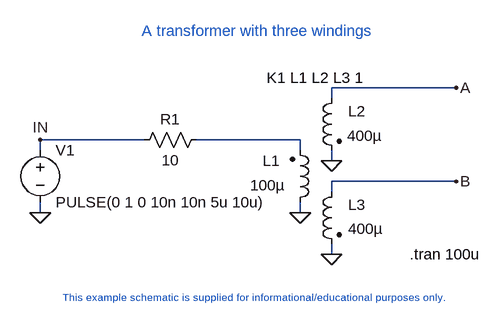
[diagram p0: schematic Transformer2.asc]
Transformer2.asc, the LTspice schematic file:
Version 4
SHEET 1 880 680
WIRE 352 96 160 96
WIRE 160 112 160 96
WIRE -128 176 -288 176
WIRE 112 176 -48 176
WIRE -288 192 -288 176
WIRE 112 192 112 176
WIRE 160 208 160 192
WIRE 352 240 160 240
WIRE 160 256 160 240
WIRE -288 288 -288 272
WIRE 112 288 112 272
WIRE 160 352 160 336
FLAG -288 288 0
FLAG 160 352 0
FLAG 112 288 0
FLAG 160 208 0
FLAG 352 96 A
FLAG 352 240 B
FLAG -288 176 IN
SYMBOL ind2 96 288 M180
WINDOW 0 -15 80 Right 2
WINDOW 3 -7 42 Right 2
SYMATTR InstName L1
SYMATTR Value 100µ
SYMATTR Type ind
SYMBOL ind2 176 96 M0
WINDOW 0 -10 36 Right 2
WINDOW 3 -8 74 Right 2
SYMATTR InstName L2
SYMATTR Value 400µ
SYMATTR Type ind
SYMBOL voltage -288 176 R0
SYMATTR InstName V1
SYMATTR Value PULSE(0 1 0 10n 10n 5u 10u)
SYMBOL res -32 160 R90
WINDOW 0 0 56 VBottom 2
WINDOW 3 32 56 VTop 2
SYMATTR InstName R1
SYMATTR Value 10
SYMBOL ind2 176 240 M0
WINDOW 0 -10 36 Right 2
WINDOW 3 -10 73 Right 2
SYMATTR InstName L3
SYMATTR Value 400µ
SYMATTR Type ind
TEXT 136 96 Bottom 2 !K1 L1 L2 L3 1
TEXT 280 352 Left 2 !.tran 100u
TEXT 32 408 Top 1 ;This example schematic is supplied for informational/educational purposes only.
TEXT 48 24 Bottom 2 ;A transformer with three windings

The netlist it stands for:
* Transformer2.asc
L1 0 N001 100µ
L2 A 0 400µ
V1 IN 0 PULSE(0 1 0 10n 10n 5u 10u)
R1 N001 IN 10
L3 B 0 400µ
K1 L1 L2 L3 1
.tran 100u
* This example schematic is supplied for informational/educational purposes only.
* A transformer with three windings
.backanno
.end